# Altium project 8ch_RGB_Controller.PrjPcb
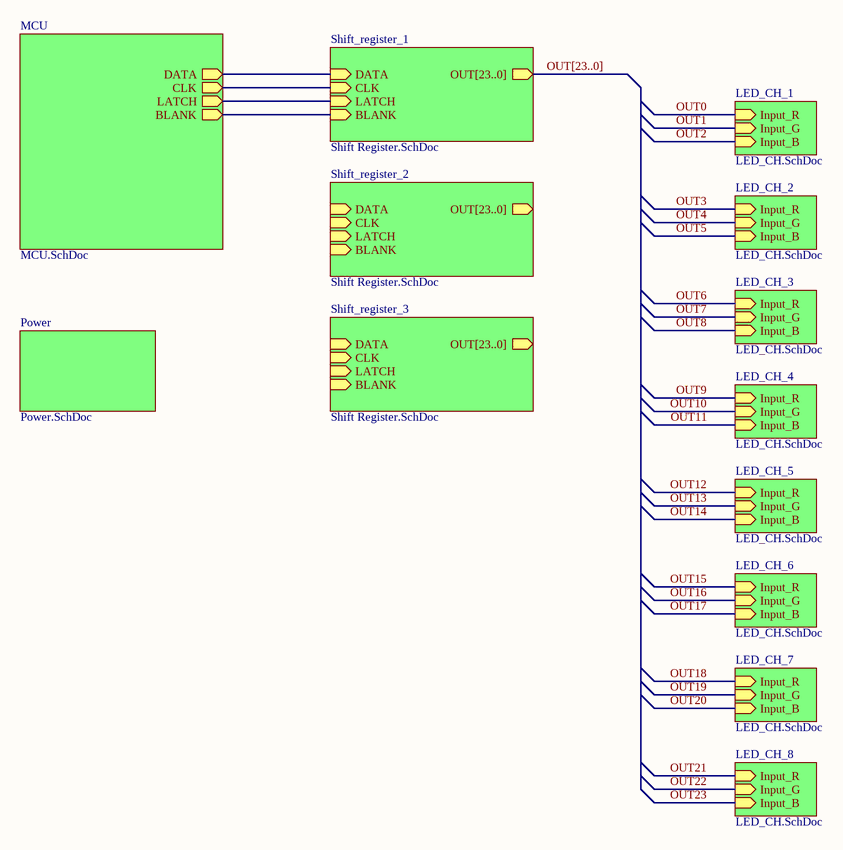
[diagram p0: Top_Level.SchDoc]
5 sheets, 103 parts. Net scope: hierarchical (ports join the sheet entries above them; power ports are global).
Board file: 8ch_RGB_Controller.PcbDoc
Sheets:
  Top_Level.SchDoc
    Power = Power.SchDoc
    MCU = MCU.SchDoc
    LED_CH_1 = LED_CH.SchDoc
    LED_CH_2 = LED_CH.SchDoc
    LED_CH_3 = LED_CH.SchDoc
    LED_CH_4 = LED_CH.SchDoc
    LED_CH_5 = LED_CH.SchDoc
    LED_CH_6 = LED_CH.SchDoc
    LED_CH_7 = LED_CH.SchDoc
    LED_CH_8 = LED_CH.SchDoc
    Shift_register_1 = Shift Register.SchDoc
    Shift_register_2 = Shift Register.SchDoc
    Shift_register_3 = Shift Register.SchDoc

## Sheet Top_Level.SchDoc
size A3; DocumentNumber: 1; SheetNumber: 1; SheetTotal: 5

### Sub-sheets
LED_CH_1 = LED_CH.SchDoc: Input_G (in), Input_B (in), Input_R (in)
LED_CH_2 = LED_CH.SchDoc: Input_G (in), Input_B (in), Input_R (in)
LED_CH_3 = LED_CH.SchDoc: Input_G (in), Input_B (in), Input_R (in)
LED_CH_4 = LED_CH.SchDoc: Input_G (in), Input_B (in), Input_R (in)
LED_CH_5 = LED_CH.SchDoc: Input_G (in), Input_B (in), Input_R (in)
LED_CH_6 = LED_CH.SchDoc: Input_G (in), Input_B (in), Input_R (in)
LED_CH_7 = LED_CH.SchDoc: Input_G (in), Input_B (in), Input_R (in)
LED_CH_8 = LED_CH.SchDoc: Input_G (in), Input_B (in), Input_R (in)
MCU = MCU.SchDoc: DATA (out), CLK (out), LATCH (out), BLANK (out)
Power = Power.SchDoc: no entries
Shift_register_1 = Shift Register.SchDoc: DATA (in), CLK (in), LATCH (in), BLANK (in), OUT[23..0] (out)
Shift_register_2 = Shift Register.SchDoc: DATA (in), CLK (in), LATCH (in), BLANK (in), OUT[23..0] (out)
Shift_register_3 = Shift Register.SchDoc: DATA (in), CLK (in), LATCH (in), BLANK (in), OUT[23..0] (out)

### Nets
NetR?_Shift_register_1#2_2: sheet MCU/LATCH, sheet Shift_register_1/LATCH
NetU?_6: sheet MCU/BLANK, sheet Shift_register_1/BLANK
NetU?_17: sheet MCU/CLK, sheet Shift_register_1/CLK
NetU?_19: sheet MCU/DATA, sheet Shift_register_1/DATA

### Buses and harness runs
bus OUT[23..0] = sheet Shift_register_1/OUT[23..0]

### Notes on the sheet
- Title:
- Author:
- Approved:
- Size:
- Date:
- Git Hash:
- A3
- Prj:
- SW Version:
- Variant:
- Edited:
- CONFIDENTIAL
- File:

## Sheet Power.SchDoc
size A4; DocumentNumber: 2; SheetNumber: 4; SheetTotal: 4
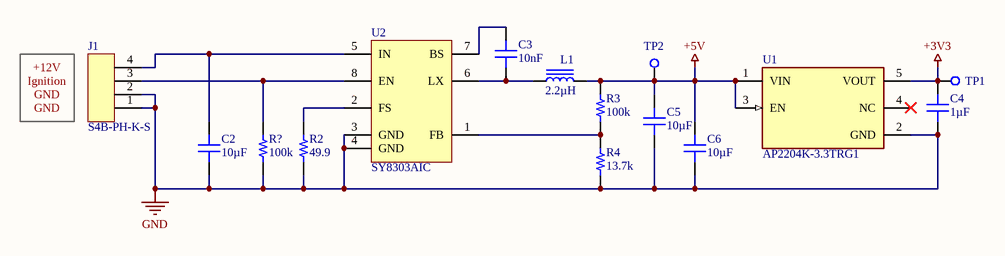
[diagram p1: Power.SchDoc]

### Parts
(Parts that share a designator on the sheet are numbered #1, #2 ... from top to bottom, then left to right.)
C2  Capacitance: 10µF  [CAPC3216X16N]  (hidden comment: CL31A106KAHNNNE)
C3  Capacitance: 10nF  [CAPC1608X08N]  (hidden comment: CC0603KRX7R9BB103)
C4  Capacitance: 1µF  [CAPC1608X08N]  (hidden comment: GRM185R61C105KE44D)
C5  Capacitance: 10µF  [CAPC2012X13N]  (hidden comment: CL21B106KOQNNNE)
C6  Capacitance: 10µF  [CAPC2012X13N]  (hidden comment: CL21B106KOQNNNE)
J1  S4B-PH-K-S  [S4B-PH-K-S]
L1  Inductance: 2.2µH  [INDP5852X48N]  (hidden comment: CMLF0504-2R2MTT)
R2  Resistance: 49.9  [RESC1608X06N]  (hidden comment: RC0603FR-0749R9L)
R3  Resistance: 100k  [RESC1608X06N]  (hidden comment: RC0603FR-13100KL)
R4  Resistance: 13.7k  [RESC1608X06N]  (hidden comment: RC0603FR-0713K7L)
R?#1  Resistance: 100k  [RESC1608X06N]  (hidden comment: RC0603FR-13100KL)
TP1  TP_TH_1MM  [TP_TH_1MM_N]  (value not drawn)
TP2  TP_TH_1MM  [TP_TH_1MM_N]  (value not drawn)
U1  AP2204K-3.3TRG1  [FP-SOT25-IPC_B]
U2  SY8303AIC  [SOT65P280X110-8N]

### Nets
+3V3: C4.2 TP1.1(TP) U1.5(VOUT)
+5V: C5.1 C6.1 L1.2 R3.2 TP2.1(TP) U1.1(VIN) U1.3(EN)
GND: C2.2 C4.1 C5.2 C6.2 J1.1 J1.2 R2.1 R4.1 R?#1.1 U1.2(GND) U2.3(GND) U2.4(GND)
NetC2_1: C2.1 J1.4 U2.5(IN)
NetC3_1: C3.1 L1.1 U2.6(LX)
NetC3_2: C3.2 U2.7(BS)
NetJ1_3: J1.3 R?#1.2 U2.8(EN)
NetR2_2: R2.2 U2.2(FS)
NetR3_1: R3.1 R4.2 U2.1(FB)

Not connected (* = marked no-connect by the designer): U1 4(NC)*

### Notes on the sheet
- (near J1) Ignition
- +12V
- GND
- Title:
- Author:
- Approved:
- Size:
- Date:
- Git Hash:
- A4
- Prj:
- SW Version:
- Variant:
- Edited:
- CONFIDENTIAL
- File:

### Library data of the parts
C2 = CMP-178-0009-1: CAP CER 10UF 25V X5R 1206; Manufacturer: Samsung Electro-Mechanics; Tolerance: 10%; Max Operating Temperature: 85°C; Case/Package: 1206; Case Code (Metric): 3216; Contact Plating: Tin; Depth: 1.6mm; Number of Pins: 2; Height: 1.6mm; Voltage: 25V; Voltage Rating: 25V; Dielectric Material: X5R; Lead Free: Lead Free; Dielectric: X5R; Width: 1.6002mm; Voltage Rating (DC): 25V; Case Code (Imperial): 1206; Min Operating Temperature: -55°C; Length: 3.2mm; Radiation Hardening: No; Thickness: 1.8034mm; Packaging: Tape and Reel; Mount: Surface Mount; Manufacturer Part Number: CL31A106KAHNNNE
C3 = CMP-178-0014-1: 10nF ±10% 50V X7R 0603 Multilayer Ceramic Capacitors MLCC - SMD/SMT RoHS; Manufacturer: Yageo; Insulation Resistance: 100G; Tolerance: 10%; Case Code (Imperial): 0603; Number of Pins: 2; Packaging: Tape and Reel; Voltage Rating (DC): 50V; Case/Package: 0603; Voltage: 50V; REACH SVHC: No SVHC; Manufacturer Part Number: CC0603KRX7R9BB103; Package Quantity: 1; Min Operating Temperature: -55°C; Mount: Surface Mount; Voltage Rating: 50V; Thickness: 889µm; Radiation Hardening: No; Lead Free: Lead Free; Width: 787.4µm; Case Code (Metric): 1608; Termination: SMD/SMT; Halogen Free: Halogen Free; Depth: 800µm; Height: 800µm; Length: 1.6mm; Max Operating Temperature: 125°C; Dielectric: X7R
C4 = CMP-178-0007-2: GRM185R61C105KE44D <CA; Manufacturer: Murata; Voltage: 16V; Dielectric Material: X5R; Tolerance: 10%; Depth: 800µm; Termination: SMD/SMT; Height: 500µm; Lead Free: Lead Free; Case/Package: 0603; Case Code (Imperial): 0603; Max Operating Temperature: 85°C; Voltage Rating: 16V; Min Operating Temperature: -55°C; Mount: Surface Mount; Number of Pins: 2; Packaging: Tape and Reel; Width: 800µm; Radiation Hardening: No; Package Quantity: 1; Thickness: 508µm; Dielectric: X5R; Voltage Rating (DC): 16V; Case Code (Metric): 1608; Manufacturer Part Number: GRM185R61C105KE44D; Length: 1.6mm; REACH SVHC: No SVHC
C5 C6 = CMP-178-0005-2: SAMSUNG ELECTRO-MECHANICS - CL21B106KOQNNNE. - CAP, 10UF, 16V, MLCC, 0805; Dielectric Material: X7R; Tolerance: 10%; Packaging: Tape and Reel; Package Quantity: 1; Dielectric: X7R; Mount: Surface Mount; Case Code (Imperial): 0805; Thickness: 1.397mm; Min Operating Temperature: -55°C; Length: 2mm; Manufacturer Part Number: CL21B106KOQNNNE; Voltage: 16V; Radiation Hardening: No; Number of Pins: 2; Depth: 1.25mm; Voltage Rating (DC): 16V; Height: 1.25mm; Max Operating Temperature: 125°C; Contact Plating: Tin; Case/Package: 0805; Case Code (Metric): 2012; Width: 1.2446mm; Voltage Rating: 16V; Manufacturer: SAMSUNG ELECTRO-MECHANICS
J1 = CMP-00003-3: JST (JAPAN SOLDERLESS TERMINALS) - S4B-PH-K-S (LF)(SN) - CONNECTOR, HEADER, 2MM, 4 POSITION, 1ROW; Voltage Rating: 100V; Number of Positions: 4; Insulation Resistance: 1G; Gender: Male; Max Current Rating: 2A; Contact Resistance: 10m; Connector Type: Male Pin; Mount: Through Hole; REACH SVHC: No SVHC; Height: 9.4mm; Fastening Type: Detent; Length: 9.9mm; Contact Plating: Tin; Flammability Rating: UL94 V-0; Max Operating Temperature: 85°C; Width: 4.5mm; Color: Natural,White; Working Voltage: 100V; Number of Pins: 4; Lead Free: Lead Free; Lead Pitch: 2mm; Voltage Rating (AC): 100V; Operating Supply Voltage: 100V; Number of Poles: 4; Termination: Solder; Number of Rows: 1; Max Voltage Rating (DC): 100V; Housing Color: Natural; Max Voltage Rating (AC): 100V; Contact Mating Length: 0.13inch; Pitch: 2mm; Number of Contacts: 4; Packaging: Bulk; Current: 2A; Current Rating: 2A; Orientation: Right Angle; Voltage: 100V; Voltage Rating (DC): 100V; Min Operating Temperature: -25°C; Contact Material: Tin,Brass,Bronze
L1 = CMP-167-0004-1: 2.2uH ±20% 4.8A 35mΩ SMD,5.8x5.2x4.5mm Power Inductors RoHS; Manufacturer: Cybermax; Core Material: Ferrite; Current Rating: 3.8A; DC Resistance (DCR): 35m; RMS Current (Irms): 3A; Length: 5.8mm; Saturation Current: 3.8A; Manufacturer Part Number: CMLF0504-2R2MTT; Mount: SMT; Case/Package: 5.8*5.2*4.5; Height: 4.5mm; Inductance Tolerance: 20%; Height - Seated (Max): 4.5mm; Tolerance: 20%; Current: 3.8A; Width: 5.2mm; Max DC Current: 3.8A; Number of Pins: 2; DC Current: 3.8A
R2 = CMP-186-0012-3: Yageo RC Series Thick Film Surface Mount Resistor 0603 Case 49.9 1% 0.1W 100ppm/C; Temperature Coefficient: 100ppm/°C; Voltage Rating: 50V; Power Rating: 100mW; Case Code (Imperial): 0603; Lead Free: Lead Free; Case/Package: 0603; Case Code (Metric): 1608; Depth: 800µm; Max Operating Temperature: 155°C; Length: 1.6mm; Tolerance: 1%; Manufacturer: Yageo; Military Standard: Not; Manufacturer Part Number: RC0603FR-0749R9L; REACH SVHC: No SVHC; Min Operating Temperature: -55°C; Number of Pins: 2; Termination: SMD/SMT; Voltage Rating (DC): 50V; Packaging: Tape and Reel; Composition: Thick Film; Height: 450µm
R3 R?#1 = CMP-186-0032-1: Res Thick Film 0603 100K Ohm 1% 0.1W(1/10W) ±100ppm/C Pad SMD T/R; Manufacturer: Yageo; Voltage Rating: 50V; Power Rating: 100mW; Number of Contacts: 2; Temperature Coefficient: 100ppm/°C; Mount: SMT; Resistor Type: Thick Film; Length: 1.6mm; Lead Free: Lead Free; Depth: 800µm; Height: 450µm; Width: 800µm; Case/Package: 0603; Voltage Rating (DC): 50V; REACH SVHC: Unknown; Number of Terminations: 2; Tolerance: 1%; Military Standard: Not; Case Code (Imperial): 0603; Termination: SMD/SMT; Packaging: Tape and Reel; Manufacturer Part Number: RC0603FR-13100KL; Number of Pins: 2; Min Operating Temperature: -55°C; Max Operating Temperature: 155°C; Case Code (Metric): 1608
R4 = CMP-186-0033-1: 13.7kΩ ±1% 0.1W ±100ppm/℃ 0603 Chip Resistor - Surface Mount RoHS; Manufacturer: Yageo; Voltage Rating: 75V; Temperature Coefficient: 100ppm/°C; Number of Contacts: 2; Voltage Rating (DC): 50V; Power Rating: 100mW; Width: 800µm; Military Standard: Not; Weight: 2.0128mg; Case/Package: 0603; Length: 1.6mm; Case Code (Imperial): 0603; Lead Free: Lead Free; Number of Pins: 2; Depth: 800µm; Max Operating Temperature: 155°C; Height: 450µm; Packaging: Tape and Reel; Manufacturer Part Number: RC0603FR-0713K7L; Termination: SMD/SMT; Tolerance: 1%; Number of Terminations: 2; Case Code (Metric): 1608; Mount: SMT; Min Operating Temperature: -55°C
TP1 TP2 = CMP-001-0001-1: Test point, 1mm, TH; Test signal: Test
U1 = CMP-2000-05782-2: IC REG LINEAR 3.3V 150MA SOT23-5; Max Input Voltage: 24V; Min Input Voltage: 2.3V; Quiescent Current: 50uA; Number of Regulators: 1; Max Output Current: 250mA; Reference Voltage: 1.24V; Output Type: Fixed; Polarity: Positive; Dropout Voltage: 360mV; Weight: 0.001058oz; Min Operating Temperature: -40°C; Output Current: 150mA; Lead Free: Lead Free; Length: 3.02mm; Height: 1.3mm; Width: 1.7mm; Case/Package: SOT-23-5; Max Operating Temperature: 85°C; Package Quantity: 3000; Mount: Surface Mount; Output Voltage: 3.3V; Number of Pins: 5; Packaging: Tape and Reel; Number of Outputs: 1
U2 = CMP-126-0005-3: High Efficiency, Fast Response, 3A, 40V Input, Synchronous Step Down Regulator; Manufacturer: Silergy; Min Input Voltage (DC): 4.5V; Frequency: 2.5MHz; Number of Outputs: 1; Efficiency: 98; Height: 1.1mm; Width: 3mm; Max Input Voltage: 40V; Case/Package: TSOT23-8; Length: 3mm; Number of Pins: 8; Max Input Voltage (DC): 40V; Current - Output 1: 3A; Output Current: 3A; Min Input Voltage: 4.5V; Manufacturer Part Number: SY8303AIC; Max Operating Temperature: 105°C; Max Output Current: 3A; Mount: SMT; Min Operating Temperature: -40°C

## Sheet MCU.SchDoc
size A4; Organization: Altium Limited; Address1: L3, 12a Rodborough Rd; Address2: Frenchs Forest; Address3: NSW; Address4: Australia 2086
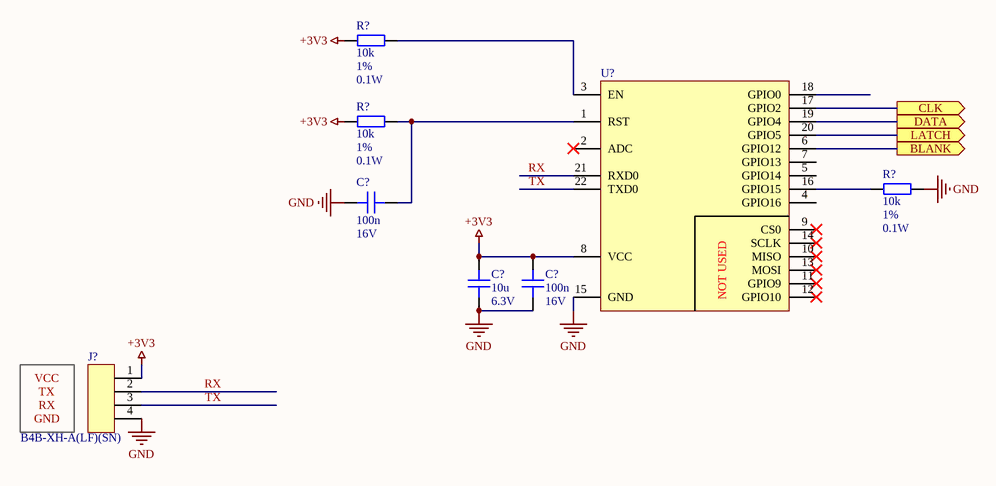
[diagram p2: MCU.SchDoc]

### Parts
(Parts that share a designator on the sheet are numbered #1, #2 ... from top to bottom, then left to right.)
C?#1  Capacitance: 100n  Voltage - Rated: 16V  [CAPC1608X09N]  (hidden comment: 0603B104K160NT)
C?#2  Capacitance: 10u  Voltage - Rated: 6.3V  [CAPC1608X09N]  (hidden comment: 0603X106K6R3NT)
C?#3  Capacitance: 100n  Voltage - Rated: 16V  [CAPC1608X09N]  (hidden comment: 0603B104K160NT)
J?  B4B-XH-A(LF)(SN)  [B4B-XH-A]
R?#2  Resistance: 10k  Tolerance: 1%  Power (Watts): 0.1W  [RESC1608X06N]  (hidden comment: WR06X1002FTL)
R?#3  Resistance: 10k  Tolerance: 1%  Power (Watts): 0.1W  [RESC1608X06N]  (hidden comment: WR06X1002FTL)
R?#4  Resistance: 10k  Tolerance: 1%  Power (Watts): 0.1W  [RESC1608X06N]  (hidden comment: WR06X1002FTL)
U?  ESP-12F  [ESP-12F]  (value not drawn)

### Ports
BLANK (out), CLK (out), DATA (out), LATCH (out)

### Nets
+3V3: C?#2.2 C?#3.2 J?.1 R?#2.1 R?#3.1 U?.8(VCC)
GND: C?#1.2 C?#2.1 C?#3.1 J?.4 R?#4.2 U?.15(GND)
RX: J?.2 U?.21(RXD0)
TX: J?.3 U?.22(TXD0)
NetC?#1_1: C?#1.1 R?#3.2 U?.1(RST)
NetR?#2_2: R?#2.2 U?.3(EN)
NetR?#4_1: R?#4.1 U?.16(GPIO15)
NetR?_Shift_register_1#2_2: U?.20(GPIO5) ; port LATCH
NetU?_6: U?.6(GPIO12) ; port BLANK
NetU?_17: U?.17(GPIO2) ; port CLK
NetU?_19: U?.19(GPIO4) ; port DATA

Not connected (* = marked no-connect by the designer): U? 2(ADC)* 4(GPIO16) 5(GPIO14) 7(GPIO13) 9(CS0)* 10(MISO)* 11(GPIO9)* 12(GPIO10)* 13(MOSI)* 14(SCLK)* 18(GPIO0)

### Notes on the sheet
- VCC
- TX
- RX
- GND
- Title:
- Author:
- Approved:
- Size:
- Date:
- Git Hash:
- A4
- Prj:
- SW Version:
- Variant:
- Edited:
- CONFIDENTIAL
- File:
- (in symbol ESP-12F) NOT USED

### Library data of the parts
C?#1 C?#3 = 0603B104K160NT: 16V 100nF X7R ±10% 0603 Multilayer Ceramic Capacitors MLCC - SMD/SMT ROHS; Manufacturer: FH (Guangdong Fenghua Advanced Tech); Product Status: Active; PartNumber: 0603B104K160NT; ComponentLink1URL: https://datasheet.lcsc.com/lcsc/2201241400_FH--Guangdong-Fenghua-Advanced-Tech-0603B104K160NT_C2846678.pdf; ComponentLink1Description: Datasheet; Package: 0603; Series: -; Tolerance: 10%; Temperature Coefficient: X7R; Operating Temperature: -55 - 125 ℃; Features: -; Ratings: -; Applications: -; Failure Rate: -; Mounting Type: SMT; Package/Case: 0603; Size/Dimension: 1.6 x 0.8mm; Height-Seated (Max): 0.8mm; Thickness (Max): -; Lead Spacing: -; Lead Style: -
C?#2 = 0603X106K6R3NT: 6.3V 10uF X5R ±10% 0603 Multilayer Ceramic Capacitors MLCC - SMD/SMT ROHS; Manufacturer: FH (Guangdong Fenghua Advanced Tech); Product Status: Active; PartNumber: 0603X106K6R3NT; ComponentLink1URL: https://datasheet.lcsc.com/lcsc/2201241400_FH--Guangdong-Fenghua-Advanced-Tech-0603B104K160NT_C2846678.pdf; ComponentLink1Description: Datasheet; Package: 0603; Series: -; Tolerance: 10%; Temperature Coefficient: X5R; Operating Temperature: -55 - 125 ℃; Features: -; Ratings: -; Applications: -; Failure Rate: -; Mounting Type: SMT; Package/Case: 0603; Size/Dimension: 1.6 x 0.8mm; Height-Seated (Max): 0.8mm; Thickness (Max): -; Lead Spacing: -; Lead Style: -
J? = CMP-00006-1: JST (JAPAN SOLDERLESS TERMINALS) - B4B-XH-A (LF)(SN) - Wire-To-Board-Steckverbinder, vertikal, 2.5 mm, 4 Kontakt(e), Stiftleiste, Baureihe XH; Voltage Rating (AC): 250V; Connector Type: Male Pin; Insulation Resistance: 1G; Current: 3A; Contact Resistance: 2m; Number of Positions: 4; Pitch: 2.5mm; Wire/Cable Gauge: 22AWG; Gender: Male; Number of Rows: 1; Max Operating Temperature: 85°C; Housing Color: White; Housing Material: Polyamide; Color: Natural; Length: 12.4mm; Contact Plating: Tin,Copper,Lead; Orientation: Straight; Lead Pitch: 2.5mm; Max Voltage Rating (AC): 250V; Contact Material: Brass; Termination: Press-Fit; Max Voltage Rating (DC): 250V; REACH SVHC: No SVHC; Lead Free: Lead Free; Max Current Rating: 3A; Depth: 5.75mm; Number of Contacts: 4; Voltage Rating: 250V; Packaging: Bulk; Min Operating Temperature: -25°C; Material: Polyamide; Current Rating: 3A; Mount: Through Hole; Package Quantity: 500
R?#2-R?#4 = WR06X1002FTL: 100mW 75V ±100ppm/℃ ±1% -55℃~+155℃ 10kΩ 0603 Chip Resistor - Surface Mount ROHS; Manufacturer: Walsin Tech Corp; Product Status: Active; PartNumber: WR06X1002FTL; ComponentLink1URL: https://datasheet.lcsc.com/lcsc/1811151132_Walsin-Tech-Corp-WR06X1002FTL_C108449.pdf; ComponentLink1Description: Datasheet; Package: 0603; Series: -; Composition: -; Features: -; Temperature Coefficient: 100ppm/℃; Operating Temperature: -55 -155 ℃; Package/Case: 0603; Ratings: 75V; Size/Dimension: 1.6 x 0.8mm; Height-Seated (Max): 0.6mm; Number of Terminations: -; Failure Rate: -
U? = ESP-12F: WIFI Module based on ESP8266EX; Manufacturer: Shenzhen Ai-Thinker Technology; Product Status: Active; RF Family/Standard: Wi-Fi; Protocol: 802.11b/g/n; Frequency: 2400 MHz ~ 2483.5 MHz; Data Rate: 72.2 Mbps; Power - Output: +17dBm max; Serial Interfaces: SPI, I2C, UART; Memory Size: 4MB Flash; Voltage - Supply: 3.0-3.6V; Current - Receiving: 0.056A; Current - Transmitting: 0.17A (peak up to 500mA); PartNumber: ESP-12F; ComponentLink1URL: https://docs.ai-thinker.com/_media/esp8266/docs/esp-12f_product_specification_en.pdf; ComponentLink1Description: Datasheet; Package: SMD-22; Series: -; Modulation: -; Sensitivity: -; Antenna Type: -; Utilized IC / Part: -; Mounting Type: SMT; Operating Temperature: -20 - 85 °C; Package / Case: SMD-22

## Sheet LED_CH.SchDoc
size A4; DocumentNumber: 4; SheetNumber: 4; SheetTotal: 5
Used 8 times, as channels LED_CH_1, LED_CH_2, LED_CH_3, LED_CH_4, LED_CH_5, LED_CH_6, LED_CH_7, LED_CH_8. Parts and nets are listed once, with the designators drawn on the sheet.
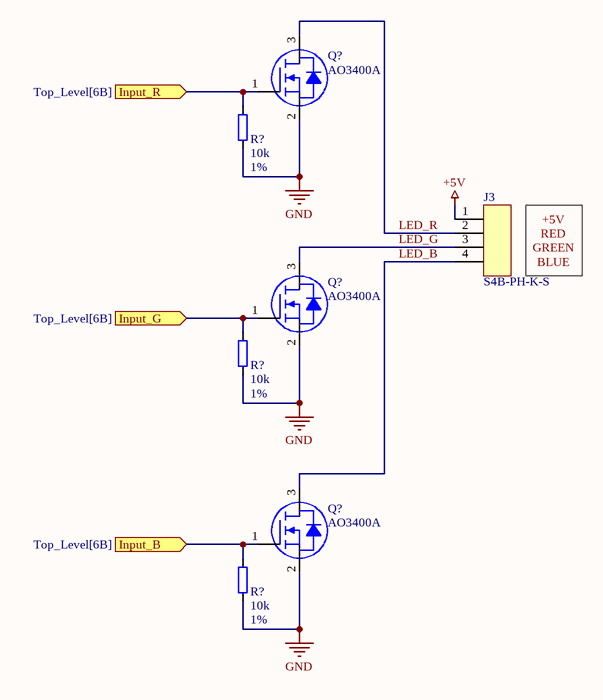
[diagram p3: LED_CH.SchDoc]

### Parts
(Parts that share a designator on the sheet are numbered #1, #2 ... from top to bottom, then left to right.)
J3  S4B-PH-K-S  [S4B-PH-K-S]
Q?#1  AO3400A  [SOT95P280X120-3N]
Q?#2  AO3400A  [SOT95P280X120-3N]
Q?#3  AO3400A  [SOT95P280X120-3N]
R?#1  Tolerance: 1%  [RESC1608X55N]  (hidden comment: 10k)
R?#2  Tolerance: 1%  [RESC1608X55N]  (hidden comment: 10k)
R?#3  Tolerance: 1%  [RESC1608X55N]  (hidden comment: 10k)

### Ports
Input_B (in, see Top_Level[6B]), Input_G (in, see Top_Level[6B]), Input_R (in, see Top_Level[6B])

### Nets
+5V: J3.1
GND: Q?#1.2(S) Q?#2.2(S) Q?#3.2(S) R?#1.1 R?#2.1 R?#3.1
Input_B: Q?#3.1(G) R?#3.2 ; port Input_B
Input_G: Q?#2.1(G) R?#2.2 ; port Input_G
Input_R: Q?#1.1(G) R?#1.2 ; port Input_R
LED_B: J3.4 Q?#3.3(D)
LED_G: J3.3 Q?#2.3(D)
LED_R: J3.2 Q?#1.3(D)

### Channels
LED_CH_1: designators J3=J3_LED_CH_1 Q?=Q?_LED_CH_1#1 Q?=Q?_LED_CH_1#3 Q?=Q?_LED_CH_1#2 R?=R?_LED_CH_1#1 R?=R?_LED_CH_1#2 R?=R?_LED_CH_1#3; ports Input_B=OUT2 Input_G=OUT1 Input_R=OUT0
LED_CH_2: designators J3=J3_LED_CH_2 Q?=Q?_LED_CH_2#1 Q?=Q?_LED_CH_2#3 Q?=Q?_LED_CH_2#2 R?=R?_LED_CH_2#1 R?=R?_LED_CH_2#2 R?=R?_LED_CH_2#3; ports Input_B=OUT5 Input_G=OUT4 Input_R=OUT3
LED_CH_3: designators J3=J3_LED_CH_3 Q?=Q?_LED_CH_3#1 Q?=Q?_LED_CH_3#3 Q?=Q?_LED_CH_3#2 R?=R?_LED_CH_3#1 R?=R?_LED_CH_3#2 R?=R?_LED_CH_3#3; ports Input_B=OUT8 Input_G=OUT7 Input_R=OUT6
LED_CH_4: designators J3=J3_LED_CH_4 Q?=Q?_LED_CH_4#1 Q?=Q?_LED_CH_4#3 Q?=Q?_LED_CH_4#2 R?=R?_LED_CH_4#1 R?=R?_LED_CH_4#2 R?=R?_LED_CH_4#3; ports Input_B=OUT11 Input_G=OUT10 Input_R=OUT9
LED_CH_5: designators J3=J3_LED_CH_5 Q?=Q?_LED_CH_5#1 Q?=Q?_LED_CH_5#3 Q?=Q?_LED_CH_5#2 R?=R?_LED_CH_5#1 R?=R?_LED_CH_5#2 R?=R?_LED_CH_5#3; ports Input_B=OUT14 Input_G=OUT13 Input_R=OUT12
LED_CH_6: designators J3=J3_LED_CH_6 Q?=Q?_LED_CH_6#1 Q?=Q?_LED_CH_6#3 Q?=Q?_LED_CH_6#2 R?=R?_LED_CH_6#1 R?=R?_LED_CH_6#2 R?=R?_LED_CH_6#3; ports Input_B=OUT17 Input_G=OUT16 Input_R=OUT15
LED_CH_7: designators J3=J3_LED_CH_7 Q?=Q?_LED_CH_7#1 Q?=Q?_LED_CH_7#3 Q?=Q?_LED_CH_7#2 R?=R?_LED_CH_7#1 R?=R?_LED_CH_7#2 R?=R?_LED_CH_7#3; ports Input_B=OUT20 Input_G=OUT19 Input_R=OUT18
LED_CH_8: designators J3=J3_LED_CH_8 Q?=Q?_LED_CH_8#1 Q?=Q?_LED_CH_8#3 Q?=Q?_LED_CH_8#2 R?=R?_LED_CH_8#1 R?=R?_LED_CH_8#2 R?=R?_LED_CH_8#3; ports Input_B=OUT23 Input_G=OUT22 Input_R=OUT21

### Notes on the sheet
- +5V
- RED
- (near J3) GREEN
- BLUE
- Title:
- Author:
- Approved:
- Size:
- Date:
- Git Hash:
- A4
- Prj:
- SW Version:
- Variant:
- Edited:
- CONFIDENTIAL
- File:

### Library data of the parts
J3 = CMP-00003-3: JST (JAPAN SOLDERLESS TERMINALS) - S4B-PH-K-S (LF)(SN) - CONNECTOR, HEADER, 2MM, 4 POSITION, 1ROW; Voltage: 100V; Number of Contacts: 4; Current Rating: 2A; Connector Type: Male Pin; Contact Resistance: 10m; Insulation Resistance: 1G; Gender: Male; Termination: Solder; Contact Mating Length: 0.13inch; Orientation: Right Angle; Pitch: 2mm; Packaging: Bulk; Contact Material: Tin,Brass,Bronze; Flammability Rating: UL94 V-0; Fastening Type: Detent; REACH SVHC: No SVHC; Max Operating Temperature: 85°C; Width: 4.5mm; Voltage Rating: 100V; Voltage Rating (DC): 100V; Voltage Rating (AC): 100V; Lead Pitch: 2mm; Max Current Rating: 2A; Length: 9.9mm; Color: Natural,White; Height: 9.4mm; Current: 2A; Mount: Through Hole; Number of Poles: 4; Max Voltage Rating (DC): 100V; Contact Plating: Tin; Max Voltage Rating (AC): 100V; Lead Free: Lead Free; Number of Positions: 4; Number of Rows: 1; Housing Color: Natural; Min Operating Temperature: -25°C; Number of Pins: 4; Operating Supply Voltage: 100V; Working Voltage: 100V
Q?#1-Q?#3 = AO3400A: MOSFET N-CH 1G2S3D; MANUFACTURER: Alpha & Omega Semicon; Part Number: AO3400A; COMPONENTLINK1URL: https://datasheet.lcsc.com/lcsc/1811081213_Alpha---Omega-Semicon-AO3400A_C20917.pdf; COMPONENTLINK1DESCRIPTION: Datasheet; PACKAGE: SOT23-3; Part Status: Active
R?#1-R?#3 = WR06X1002FTL: Resistor; Manufacturer: Walsin Tech Corp; Temperature Coefficient: 100ppm; Power: 1/10 W; Min Temperature: -55°C; Max Temperature: 155°C; ComponentLink1URL: https://datasheet.lcsc.com/lcsc/2304140030_Walsin-Tech-Corp-WR06X1002FTL_C108449.pdf; ComponentLink1Description: Datasheet; Package: 0603; Resistance: 10k; Part Number: WR06X1002FTL; Part Status: Active

## Sheet Shift Register.SchDoc: 8ch_RGB_Controller
size A4; ApprovedBy: Selyutin A.; CheckedBy: Selyutin A.; Author: Selyutin A.; CompanyName: Circuit Craft Lab; DrawnBy: Selyutin A.; Engineer: Selyutin A.; Organization: Circuit Craft Lab; Address1: Russia; Address2: Nevinnomissk; DocumentNumber: 6; Revision: 1.0; SheetNumber: 3; SheetTotal: 5
Used 3 times, as channels Shift_register_1, Shift_register_2, Shift_register_3. Parts and nets are listed once, with the designators drawn on the sheet.
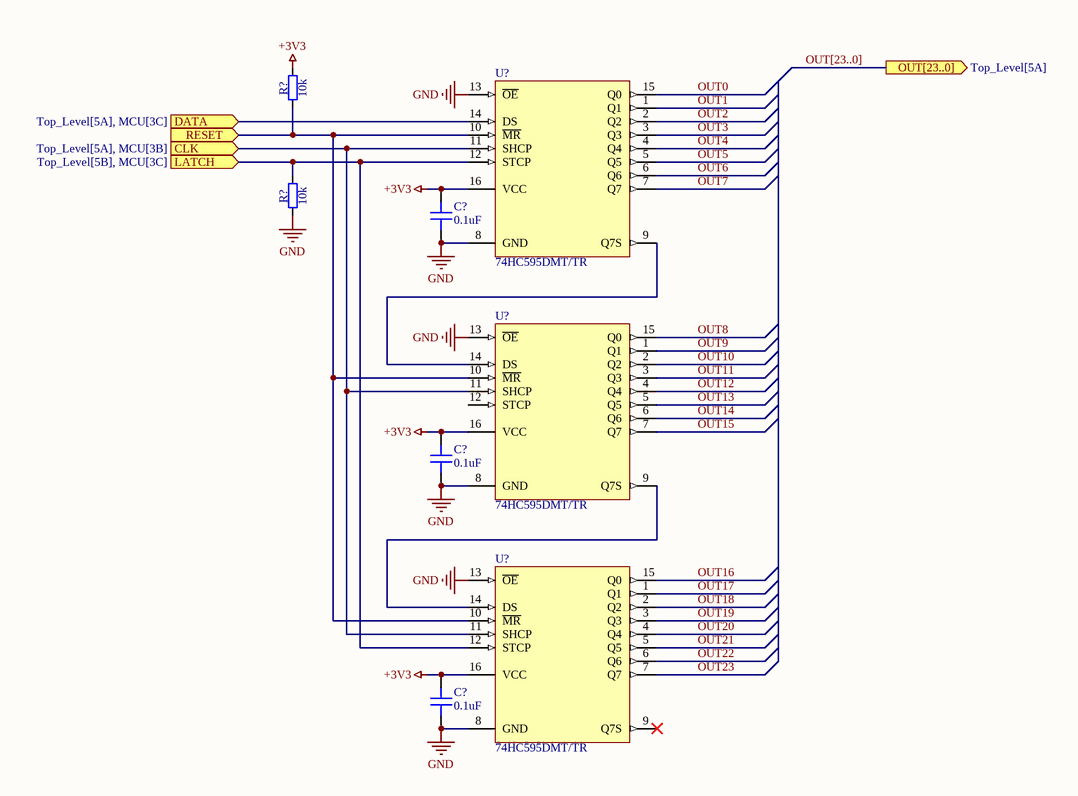
[diagram p4: Shift Register.SchDoc]

### Parts
(Parts that share a designator on the sheet are numbered #1, #2 ... from top to bottom, then left to right.)
C?#1  0.1uF  [CAPC1608X09N]
C?#2  0.1uF  [CAPC1608X09N]
C?#3  0.1uF  [CAPC1608X09N]
R?#1  10k  [RESC1608X55N]
R?#2  10k  [RESC1608X55N]
U?#1  74HC595DMT/TR  [SOP65P640X110-16N]
U?#2  74HC595DMT/TR  [SOP65P640X110-16N]
U?#3  74HC595DMT/TR  [SOP65P640X110-16N]

### Ports
CLK (in, see Top_Level[5A], MCU[3B]), DATA (in, see Top_Level[5A], MCU[3C]), LATCH (in, see Top_Level[5B], MCU[3C]), OUT[23..0] (out, see Top_Level[5A]), RESET (in)

### Nets
+3V3: C?#1.2 C?#2.2 C?#3.2 R?#1.2 U?#1.16(VCC) U?#2.16(VCC) U?#3.16(VCC)
GND: C?#1.1 C?#2.1 C?#3.1 R?#2.1 U?#1.8(GND) U?#1.13(~{OE}) U?#2.8(GND) U?#2.13(~{OE}) U?#3.8(GND) U?#3.13(~{OE})
CLK: U?#1.11(SHCP) U?#2.11(SHCP) U?#3.11(SHCP) ; port CLK
DATA: U?#1.14(DS) ; port DATA
LATCH: R?#2.2 U?#1.12(STCP) U?#3.12(STCP) ; port LATCH
OUT0: U?#1.15(Q0)
OUT1: U?#1.1(Q1)
OUT2: U?#1.2(Q2)
OUT3: U?#1.3(Q3)
OUT4: U?#1.4(Q4)
OUT5: U?#1.5(Q5)
OUT6: U?#1.6(Q6)
OUT7: U?#1.7(Q7)
OUT8: U?#2.15(Q0)
OUT9: U?#2.1(Q1)
OUT10: U?#2.2(Q2)
OUT11: U?#2.3(Q3)
OUT12: U?#2.4(Q4)
OUT13: U?#2.5(Q5)
OUT14: U?#2.6(Q6)
OUT15: U?#2.7(Q7)
OUT16: U?#3.15(Q0)
OUT17: U?#3.1(Q1)
OUT18: U?#3.2(Q2)
OUT19: U?#3.3(Q3)
OUT20: U?#3.4(Q4)
OUT21: U?#3.5(Q5)
OUT22: U?#3.6(Q6)
OUT23: U?#3.7(Q7)
RESET: R?#1.1 U?#1.10(~{MR}) U?#2.10(~{MR}) U?#3.10(~{MR}) ; port RESET
NetU?#1_9: U?#1.9(Q7S) U?#2.14(DS)
NetU?#2_9: U?#2.9(Q7S) U?#3.14(DS)

Not connected (* = marked no-connect by the designer): U?#2 12(STCP); U?#3 9(Q7S)*

### Channels
Shift_register_1: designators C?=C?_Shift_register_1#1 C?=C?_Shift_register_1#2 C?=C?_Shift_register_1#3 R?=R?_Shift_register_1#2 R?=R?_Shift_register_1#1 U?=U?_Shift_register_1#1 U?=U?_Shift_register_1#2 U?=U?_Shift_register_1#3; ports CLK=NetU?_17 DATA=NetU?_19 LATCH=NetR?_Shift_register_1#2_2 RESET=NetR?_Shift_register_1#1_1
Shift_register_2: designators C?=C?_Shift_register_2#1 C?=C?_Shift_register_2#2 C?=C?_Shift_register_2#3 R?=R?_Shift_register_2#2 R?=R?_Shift_register_2#1 U?=U?_Shift_register_2#1 U?=U?_Shift_register_2#2 U?=U?_Shift_register_2#3; ports CLK=NetU?_Shift_register_2#1_11 DATA=NetU?_Shift_register_2#1_14 LATCH=NetR?_Shift_register_2#2_2 RESET=NetR?_Shift_register_2#1_1
Shift_register_3: designators C?=C?_Shift_register_3#1 C?=C?_Shift_register_3#2 C?=C?_Shift_register_3#3 R?=R?_Shift_register_3#2 R?=R?_Shift_register_3#1 U?=U?_Shift_register_3#1 U?=U?_Shift_register_3#2 U?=U?_Shift_register_3#3; ports CLK=NetU?_Shift_register_3#1_11 DATA=NetU?_Shift_register_3#1_14 LATCH=NetR?_Shift_register_3#2_2 RESET=NetR?_Shift_register_3#1_1

### Buses and harness runs
bus OUT[23..0] = port OUT[23..0]

### Notes on the sheet
- Title:
- Author:
- Approved:
- Size:
- Date:
- Git Hash:
- A4
- Prj:
- SW Version:
- Variant:
- Edited:
- CONFIDENTIAL
- File:

### Library data of the parts
C?#1-C?#3 = 0603B104K500NT: Manufacturer: FH (Guangdong Fenghua Advanced Tech); Voltage: 50V; Tolerance: 10%; Dielectric: X7R; Min Temperature: -55; Max Temperature: 125; Part Number: 0603B104K500NT; ComponentLink1URL: https://datasheet.lcsc.com/lcsc/2304140030_FH--Guangdong-Fenghua-Advanced-Tech-0603B104K500NT_C30926.pdf; ComponentLink1Description: Datasheet; Package: 0603; Part Status: Active; Capacitance: 0.1uF
R?#1 R?#2 = WR06X1002FTL: Resistor; Manufacturer: Walsin Tech Corp; Tolerance: 1%; Power: 1/10 W; Temperature Coefficient: 100ppm; Min Temperature: -55°C; Max Temperature: 155°C; Part Number: WR06X1002FTL; ComponentLink1URL: https://datasheet.lcsc.com/lcsc/2304140030_Walsin-Tech-Corp-WR06X1002FTL_C108449.pdf; ComponentLink1Description: Datasheet; Package: 0603; Part Status: Active; Resistance: 10k
U?#1-U?#3 = 74HC595DMT/TR: IC SHIFT REGISTER 8BIT 16TSSOP; MANUFACTURER: HGSEMI; Part Number: 74HC595DMT/TR; COMPONENTLINK1URL: https://datasheet.lcsc.com/lcsc/2304111630_HGSEMI-74HC595DMT-TR_C5310887.pdf; COMPONENTLINK1DESCRIPTION: Datasheet; PACKAGE: TSSOP-16; Part Status: Active

## Nets that join several sheets
+3V3: Power (C4.2 TP1.1 U1.5), MCU (6 pins), Shift_register_1 (7 pins), Shift_register_2 (7 pins), Shift_register_3 (7 pins)
+5V: Power (7 pins), LED_CH_1 (J3_LED_CH_1.1), LED_CH_2 (J3_LED_CH_2.1), LED_CH_3 (J3_LED_CH_3.1), LED_CH_4 (J3_LED_CH_4.1), LED_CH_5 (J3_LED_CH_5.1), LED_CH_6 (J3_LED_CH_6.1), LED_CH_7 (J3_LED_CH_7.1), LED_CH_8 (J3_LED_CH_8.1)
GND: Power (12 pins), MCU (6 pins), LED_CH_1 (6 pins), LED_CH_2 (6 pins), LED_CH_3 (6 pins), LED_CH_4 (6 pins), LED_CH_5 (6 pins), LED_CH_6 (6 pins), LED_CH_7 (6 pins), LED_CH_8 (6 pins), Shift_register_1 (10 pins), Shift_register_2 (10 pins), Shift_register_3 (10 pins)
NetR?_Shift_register_1#2_2: MCU (U?.20), Shift_register_1 (R?_Shift_register_1#2.2 U?_Shift_register_1#1.12 U?_Shift_register_1#3.12)
NetU?_17: MCU (U?.17), Shift_register_1 (U?_Shift_register_1#1.11 U?_Shift_register_1#2.11 U?_Shift_register_1#3.11)
NetU?_19: MCU (U?.19), Shift_register_1 (U?_Shift_register_1#1.14)
OUT0: LED_CH_1 (Q?_LED_CH_1#1.1 R?_LED_CH_1#1.2), Shift_register_1 (U?_Shift_register_1#1.15)
OUT1: LED_CH_1 (Q?_LED_CH_1#2.1 R?_LED_CH_1#2.2), Shift_register_1 (U?_Shift_register_1#1.1)
OUT2: LED_CH_1 (Q?_LED_CH_1#3.1 R?_LED_CH_1#3.2), Shift_register_1 (U?_Shift_register_1#1.2)
OUT3: LED_CH_2 (Q?_LED_CH_2#1.1 R?_LED_CH_2#1.2), Shift_register_1 (U?_Shift_register_1#1.3)
OUT4: LED_CH_2 (Q?_LED_CH_2#2.1 R?_LED_CH_2#2.2), Shift_register_1 (U?_Shift_register_1#1.4)
OUT5: LED_CH_2 (Q?_LED_CH_2#3.1 R?_LED_CH_2#3.2), Shift_register_1 (U?_Shift_register_1#1.5)
OUT6: LED_CH_3 (Q?_LED_CH_3#1.1 R?_LED_CH_3#1.2), Shift_register_1 (U?_Shift_register_1#1.6)
OUT7: LED_CH_3 (Q?_LED_CH_3#2.1 R?_LED_CH_3#2.2), Shift_register_1 (U?_Shift_register_1#1.7)
OUT8: LED_CH_3 (Q?_LED_CH_3#3.1 R?_LED_CH_3#3.2), Shift_register_1 (U?_Shift_register_1#2.15)
OUT9: LED_CH_4 (Q?_LED_CH_4#1.1 R?_LED_CH_4#1.2), Shift_register_1 (U?_Shift_register_1#2.1)
OUT10: LED_CH_4 (Q?_LED_CH_4#2.1 R?_LED_CH_4#2.2), Shift_register_1 (U?_Shift_register_1#2.2)
OUT11: LED_CH_4 (Q?_LED_CH_4#3.1 R?_LED_CH_4#3.2), Shift_register_1 (U?_Shift_register_1#2.3)
OUT12: LED_CH_5 (Q?_LED_CH_5#1.1 R?_LED_CH_5#1.2), Shift_register_1 (U?_Shift_register_1#2.4)
OUT13: LED_CH_5 (Q?_LED_CH_5#2.1 R?_LED_CH_5#2.2), Shift_register_1 (U?_Shift_register_1#2.5)
OUT14: LED_CH_5 (Q?_LED_CH_5#3.1 R?_LED_CH_5#3.2), Shift_register_1 (U?_Shift_register_1#2.6)
OUT15: LED_CH_6 (Q?_LED_CH_6#1.1 R?_LED_CH_6#1.2), Shift_register_1 (U?_Shift_register_1#2.7)
OUT16: LED_CH_6 (Q?_LED_CH_6#2.1 R?_LED_CH_6#2.2), Shift_register_1 (U?_Shift_register_1#3.15)
OUT17: LED_CH_6 (Q?_LED_CH_6#3.1 R?_LED_CH_6#3.2), Shift_register_1 (U?_Shift_register_1#3.1)
OUT18: LED_CH_7 (Q?_LED_CH_7#1.1 R?_LED_CH_7#1.2), Shift_register_1 (U?_Shift_register_1#3.2)
OUT19: LED_CH_7 (Q?_LED_CH_7#2.1 R?_LED_CH_7#2.2), Shift_register_1 (U?_Shift_register_1#3.3)
OUT20: LED_CH_7 (Q?_LED_CH_7#3.1 R?_LED_CH_7#3.2), Shift_register_1 (U?_Shift_register_1#3.4)
OUT21: LED_CH_8 (Q?_LED_CH_8#1.1 R?_LED_CH_8#1.2), Shift_register_1 (U?_Shift_register_1#3.5)
OUT22: LED_CH_8 (Q?_LED_CH_8#2.1 R?_LED_CH_8#2.2), Shift_register_1 (U?_Shift_register_1#3.6)
OUT23: LED_CH_8 (Q?_LED_CH_8#3.1 R?_LED_CH_8#3.2), Shift_register_1 (U?_Shift_register_1#3.7)